# Altium schematic sheet CERRADURA.SchDoc
size A4; PageSetup: Record=PageOptions|CenterHorizontal=True|CenterVertical=True|PrintScale=1.00|XCorrection=1.00|YCorrection=1.00|PrintKind=1|BorderSize=5000000|LeftOffset=0|BottomOffset=0|Orientation=2|PaperLength=1000|PaperWidth=1000|Scale=100|PaperSource=7|PrintQuality=600|MediaType=1|DitherType=10|PaperKind=A4|PrintScaleMode=1
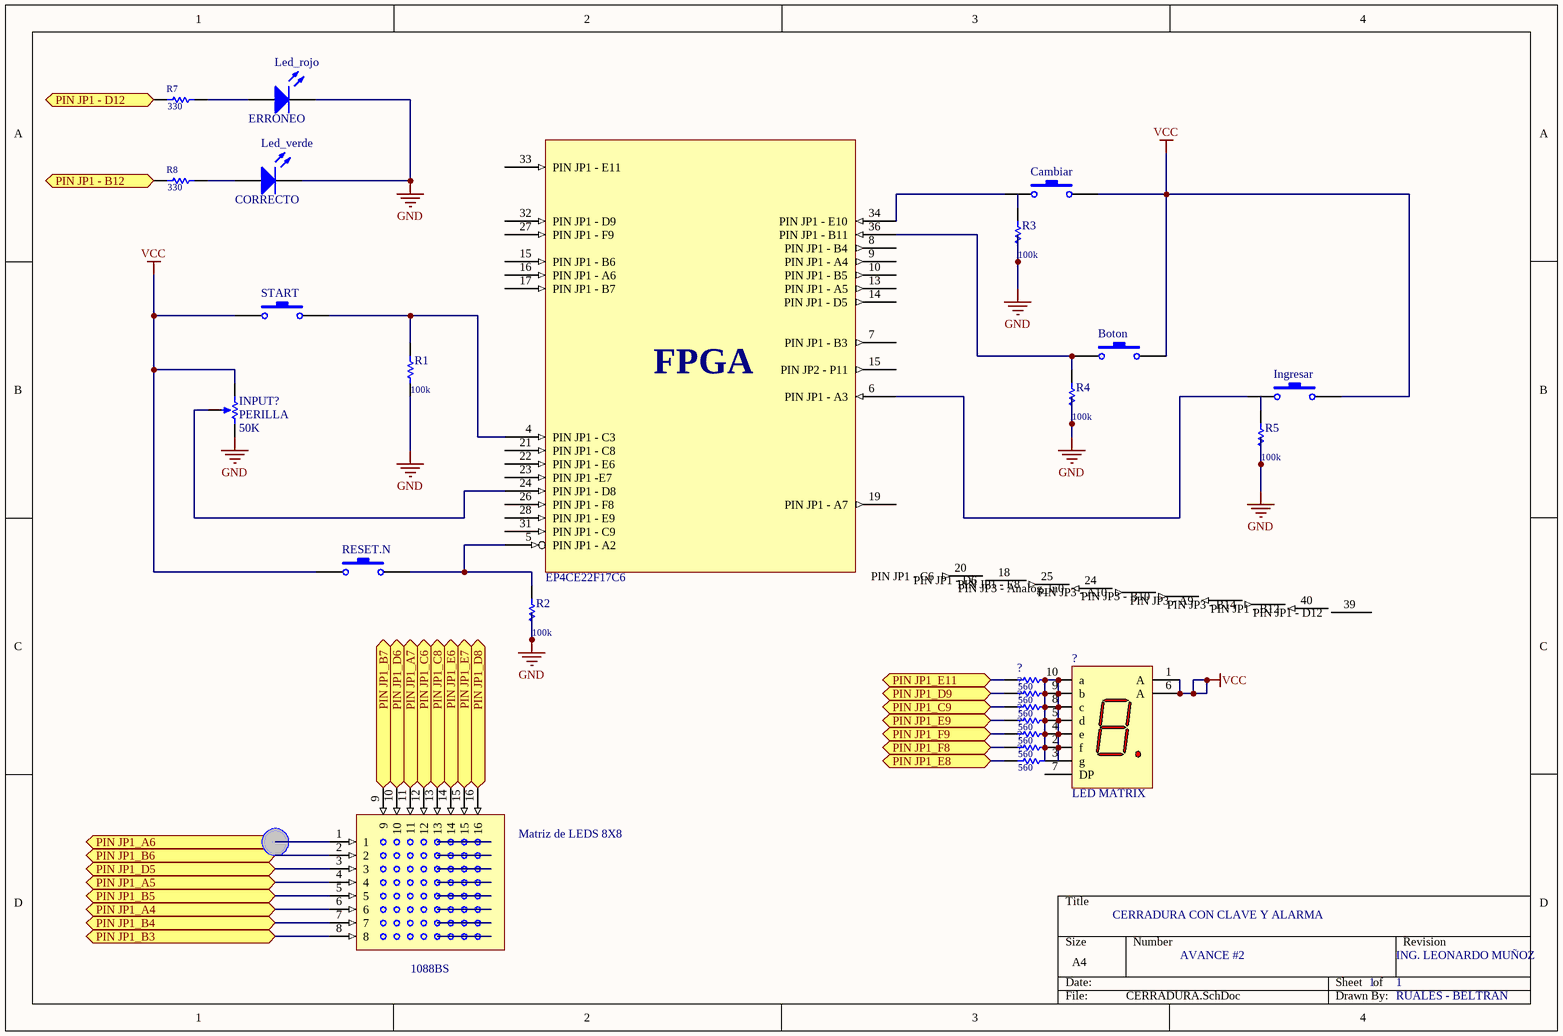
[diagram p0: CERRADURA.SchDoc]

## Parts
(Parts that share a designator on the sheet are numbered #1, #2 ... from top to bottom, then left to right.)
*  EP4CE22F17C6  (part A of 2)
?#1  value 560  [AXIAL-0.3]
?#2  LED MATRIX  [A]
?#3  value 560  [AXIAL-0.3]
?#4  value 560  [AXIAL-0.3]
?#5  value 560  [AXIAL-0.3]
?#6  value 560  [AXIAL-0.3]
?#7  value 560  [AXIAL-0.3]
?#8  value 560  [AXIAL-0.3]
Boton  (no value)  [SPST-2]
Cambiar  (no value)  [SPST-2]
Ingresar  (no value)  [SPST-2]
INPUT?  PERILLA  value 50K  [VR5]
Led_rojo  ERRONEO  [LED-0]
Led_verde  CORRECTO  [LED-0]
Matriz_de_LEDS_8X8  1088BS
R1  value 100k  [AXIAL-0.3]
R2  value 100k  [AXIAL-0.3]
R3  value 100k  [AXIAL-0.3]
R4  value 100k  [AXIAL-0.3]
R5  value 100k  [AXIAL-0.3]
R7  value 330  [AXIAL-0.3]
R8  value 330  [AXIAL-0.3]
RESET.N  (no value)  [SPST-2]
START  (no value)  [SPST-2]

## Ports
PIN JP1 - B12, PIN JP1 - D12, PIN JP1_A4, PIN JP1_A5, PIN JP1_A6, PIN JP1_A7, PIN JP1_B3, PIN JP1_B4, PIN JP1_B5, PIN JP1_B6, PIN JP1_B7, PIN JP1_C6, PIN JP1_C8, PIN JP1_C9, PIN JP1_D5, PIN JP1_D6, PIN JP1_D8, PIN JP1_D9, PIN JP1_E6, PIN JP1_E7, PIN JP1_E8, PIN JP1_E9, PIN JP1_E11, PIN JP1_F8, PIN JP1_F9

## Nets
GND: INPUT?.2(BOT) Led_rojo.2(K) Led_verde.2(K) R1.1 R2.1 R3.1 R4.1 R5.1
VCC: ?#2.1(A) ?#2.6(A) Boton.2 Cambiar.2 Ingresar.2 INPUT?.1(TOP) RESET.N.1 START.1
PIN JP1 - B12: R8.1 ; port PIN JP1 - B12
PIN JP1 - D12: R7.1 ; port PIN JP1 - D12
PIN JP1_A4: Matriz_de_LEDS_8X8.6 ; port PIN JP1_A4
PIN JP1_A5: Matriz_de_LEDS_8X8.4 ; port PIN JP1_A5
PIN JP1_A6: Matriz_de_LEDS_8X8.1 ; port PIN JP1_A6
PIN JP1_A7: Matriz_de_LEDS_8X8.11 ; port PIN JP1_A7
PIN JP1_B3: Matriz_de_LEDS_8X8.8 ; port PIN JP1_B3
PIN JP1_B4: Matriz_de_LEDS_8X8.7 ; port PIN JP1_B4
PIN JP1_B5: Matriz_de_LEDS_8X8.5 ; port PIN JP1_B5
PIN JP1_B6: Matriz_de_LEDS_8X8.2 ; port PIN JP1_B6
PIN JP1_B7: Matriz_de_LEDS_8X8.9 ; port PIN JP1_B7
PIN JP1_C6: Matriz_de_LEDS_8X8.12 ; port PIN JP1_C6
PIN JP1_C8: Matriz_de_LEDS_8X8.13 ; port PIN JP1_C8
PIN JP1_C9: ?#4.1 ; port PIN JP1_C9
PIN JP1_D5: Matriz_de_LEDS_8X8.3 ; port PIN JP1_D5
PIN JP1_D6: Matriz_de_LEDS_8X8.10 ; port PIN JP1_D6
PIN JP1_D8: Matriz_de_LEDS_8X8.16 ; port PIN JP1_D8
PIN JP1_D9: ?#3.1 ; port PIN JP1_D9
PIN JP1_E6: Matriz_de_LEDS_8X8.14 ; port PIN JP1_E6
PIN JP1_E7: Matriz_de_LEDS_8X8.15 ; port PIN JP1_E7
PIN JP1_E8: ?#8.1 ; port PIN JP1_E8
PIN JP1_E9: ?#5.1 ; port PIN JP1_E9
PIN JP1_E11: ?#1.1 ; port PIN JP1_E11
PIN JP1_F8: ?#7.1 ; port PIN JP1_F8
PIN JP1_F9: ?#6.1 ; port PIN JP1_F9
Net*_4: *.4(PIN_JP1_-_C3) R1.2 START.2
Net*_5: *.5(PIN_JP1_-_A2) R2.2 RESET.N.2
Net*_6: *.6(PIN_JP1_-_A3) Ingresar.1
Net*_24: *.24(PIN_JP1_-_D8) INPUT?.3(TAP)
Net*_34: *.34(PIN_JP1_-_E10) Cambiar.1
Net*_36: *.36(PIN_JP1_-_B11) Boton.1 R4.2
Net?#1_2: ?#1.2 ?#2.2(f) ?#2.3(g) ?#2.4(e) ?#2.5(d) ?#2.8(c) ?#2.9(b) ?#2.10(a) ?#3.2 ?#4.2 ?#5.2 ?#6.2 ?#7.2 ?#8.2
NetLed_rojo_1: Led_rojo.1(A) R7.2
NetLed_verde_1: Led_verde.1(A) R8.2

Not connected (* = marked no-connect by the designer): * 7(PIN_JP1_-_B3) 8(PIN_JP1_-_B4) 9(PIN_JP1_-_A4) 10(PIN_JP1_-_B5) 13(PIN_JP1_-_A5) 14(PIN_JP1_-_D5) 15(PIN_JP2_-_P11) 16(PIN_JP1_-_A6) 17(PIN_JP1_-_B7) 18(PIN_JP1_-_D6) 19(PIN_JP1_-_A7) 20(PIN_JP1_-_C6) 21(PIN_JP1_-_C8) 22(PIN_JP1_-_E6) 23(PIN_JP1_-E7) 25(PIN_JP1_-_E8) 26(PIN_JP1_-_F8) 27(PIN_JP1_-_F9) 28(PIN_JP1_-_E9) 31(PIN_JP1_-_C9) 32(PIN_JP1_-_D9) 33(PIN_JP1_-_E11) 39(PIN_JP1_-_D12) 40(PIN_JP1_-_B12) ?1(PIN_JP3_-_A10) ?2(PIN_JP3_-_B10) ?3(PIN_JP3_-_A9) ?4(PIN_JP3_-_B14); ?#2 7(DP); R3 2; R5 2

## Notes on the sheet
- CERRADURA CON CLAVE Y ALARMA
- AVANCE #2
- 1
- ING. LEONARDO MUÑOZ
- RUALES - BELTRAN
- (in symbol CPLD, part A) FPGA

## Library data of the parts
* = CPLD
?#1 ?#3-?#8 R1-R5 R7 R8 = Res1: Resistor; Published: 8-Jun-2000; LatestRevisionDate: 17-Jul-2002; LatestRevisionNote: Re-released for DXP Platform.; PackageReference: AXIAL-0.3; Publisher: Altium Limited; PackageDescription: Axial Device, Thru-Hole; 2 Leads; 0.3 in Pin Spacing
?#2 = Dpy Red-CA: 7.62 mm Black Surface HER 7-Segment Display: CA, RH DP; MinimumIntensity: 360 ucd; Note: IF = 5 mA; Note: Pins 1 and 6 are redundant Anodes.; Published: 8-Jun-2000; LatestRevisionDate: 17-Dec-2003; LatestRevisionNote: Schematic revised, PCB Footprint replaced.; DatasheetVersion: 19-Feb-2002; PackageVersion: 11-Feb-2002; PackageReference: A; Publisher: Altium Limited; PackageDescription: LED, 7-Segment Display, 7.62 mm, RHD; 10 Leads; Row Space 5.08 mm; Pitch 2.54 mm; Colour: High Efficiency Red (HER); ComponentLink1Description: Manufacturer Link; ComponentLink1URL: http://www.agilent.com/
Boton Cambiar Ingresar RESET.N START = SW-PB: Switch; Published: 24-Mar-1999; LatestRevisionDate: 17-Jul-2002; LatestRevisionNote: Re-released for DXP Platform.; PackageReference: SPST-2; Publisher: Altium Limited; PackageDescription: Switch; 2 Leads
INPUT? = RPot: Potentiometer; Sim Note: Enter the Resistance value and the set point into parameter fields.; Set Position: 0.5; Published: 8-Jun-2000; LatestRevisionDate: 17-Jul-2002; LatestRevisionNote: Re-released for DXP Platform.; PackageReference: VR5; Publisher: Altium Limited; PackageDescription: Variable Resistor, Thru-Hole; 3 Leads
Led_rojo Led_verde = LED0: Typical INFRARED GaAs LED; Published: 8-Jun-2000; LatestRevisionDate: 08-Jul-2005; LatestRevisionNote: Mech Layer 1 removed.; PackageReference: LED-0; Publisher: Altium Limited; PackageDescription: LED; 2 Leads